# Altium project FlightController.PrjPcb
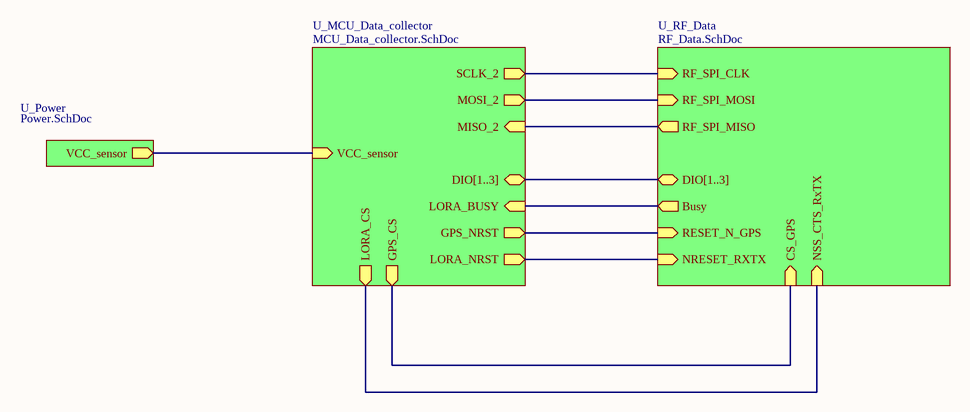
[diagram p0: Sheet1.SchDoc]
4 sheets, 100 parts. Net scope: hierarchical (ports join the sheet entries above them; power ports are global).
Board file: FlightControllerPCB.PcbDoc
Sheets:
  Sheet1.SchDoc
    U_RF_Data = RF_Data.SchDoc
    U_MCU_Data_collector = MCU_Data_collector.SchDoc
    U_Power = Power.SchDoc

## Sheet Sheet1.SchDoc
size A4; SheetNumber: 1; SheetTotal: 4

### Sub-sheets
U_MCU_Data_collector = MCU_Data_collector.SchDoc: DIO[1..3] (bidir), MOSI_2 (out), MISO_2 (in), SCLK_2 (out), LORA_CS (out), LORA_BUSY (in), LORA_NRST (out), GPS_NRST (out), GPS_CS (out), VCC_sensor (in)
U_Power = Power.SchDoc: VCC_sensor (out)
U_RF_Data = RF_Data.SchDoc: RF_SPI_CLK (in), RF_SPI_MISO (out), RF_SPI_MOSI (in), CS_GPS (in), NSS_CTS_RxTX (in), Busy (out), DIO[1..3] (bidir), NRESET_RXTX (in), RESET_N_GPS (in)

### Nets
Busy: sheet U_RF_Data/Busy, sheet U_MCU_Data_collector/LORA_BUSY
CS_GPS: sheet U_RF_Data/CS_GPS, sheet U_MCU_Data_collector/GPS_CS
GPS_NRST: sheet U_RF_Data/RESET_N_GPS, sheet U_MCU_Data_collector/GPS_NRST
LORA_CS: sheet U_RF_Data/NSS_CTS_RxTX, sheet U_MCU_Data_collector/LORA_CS
LORA_NRST: sheet U_RF_Data/NRESET_RXTX, sheet U_MCU_Data_collector/LORA_NRST
MISO_2: sheet U_RF_Data/RF_SPI_MISO, sheet U_MCU_Data_collector/MISO_2
MOSI_2: sheet U_RF_Data/RF_SPI_MOSI, sheet U_MCU_Data_collector/MOSI_2
SCLK_2: sheet U_RF_Data/RF_SPI_CLK, sheet U_MCU_Data_collector/SCLK_2
VCC_sensor: sheet U_MCU_Data_collector/VCC_sensor, sheet U_Power/VCC_sensor

### Buses and harness runs
bus sheet U_MCU_Data_collector/DIO[1..3] = sheet U_RF_Data/DIO[1..3]

## Sheet RF_Data.SchDoc
size A4; SheetNumber: 3; SheetTotal: 4
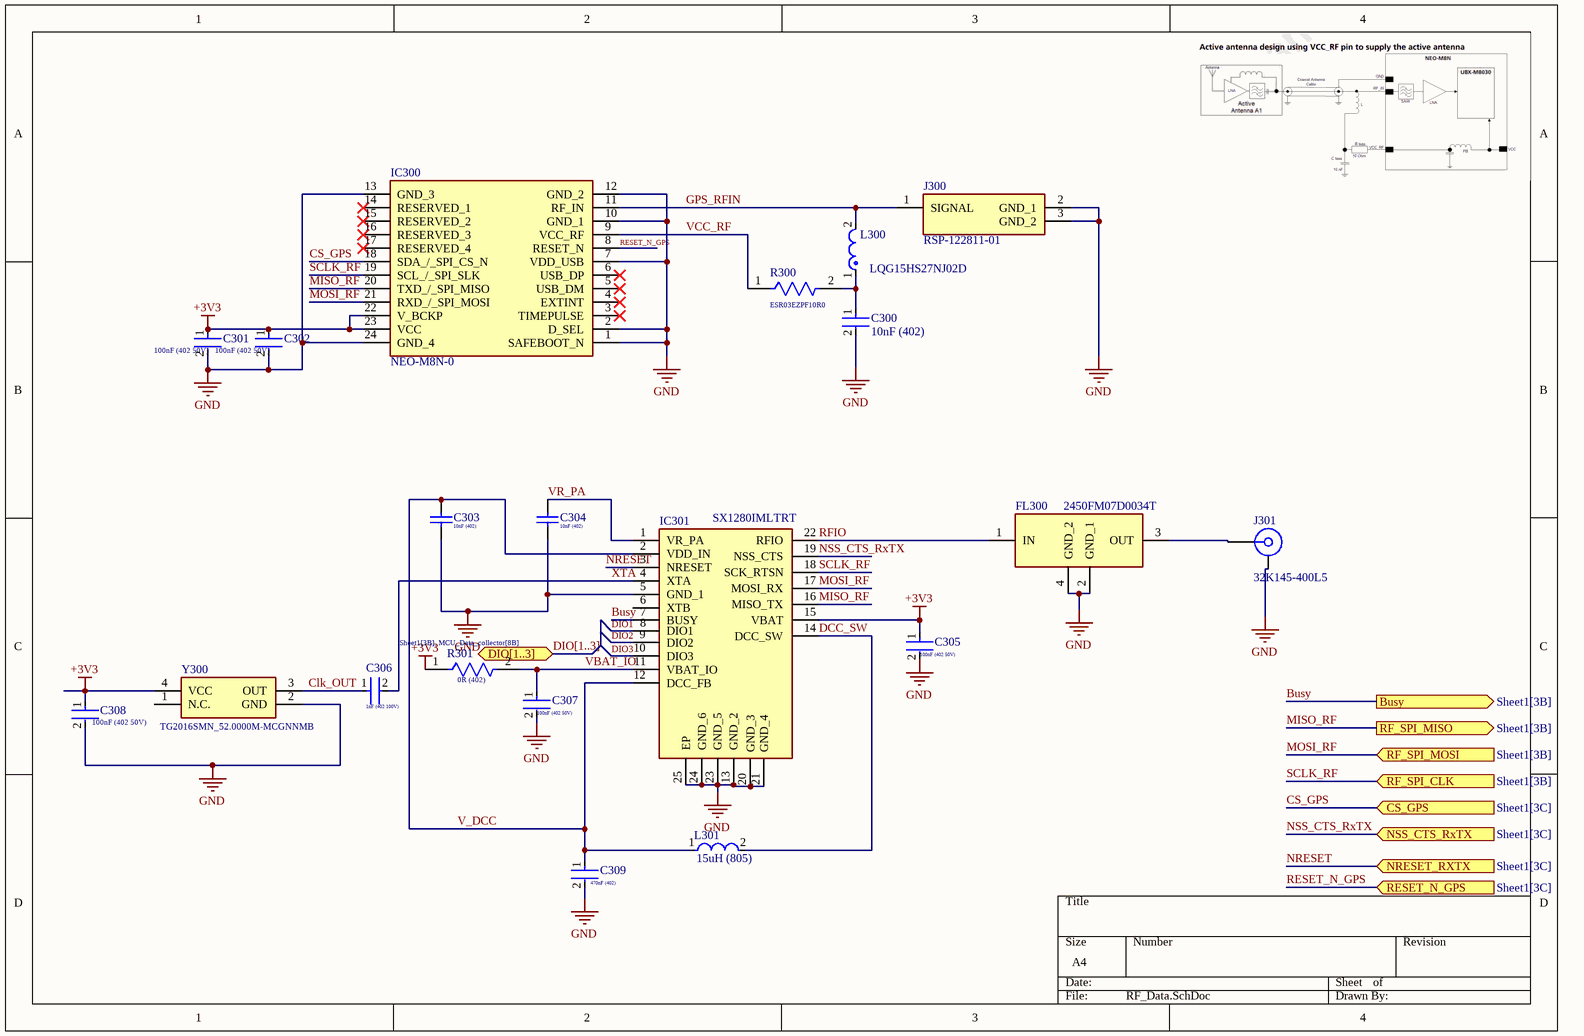
[diagram p1: RF_Data.SchDoc]

### Parts
C300  10nF (402)  [FP-CL165-IPC_C]
C301  100nF (402 50V)  [FP-CL779-IPC_C]
C302  100nF (402 50V)  [FP-CL779-IPC_C]
C303  10nF (402)  [CAPC1005X55X25LL05T10]
C304  10nF (402)  [CAPC1005X55X25LL05T10]
C305  100nF (402 50V)  [FP-CL779-IPC_C]
C306  1nF (402 100V)  [FP-GCM155-0_05-MFG]
C307  100nF (402 50V)  [FP-CL779-IPC_C]
C308  100nF (402 50V)  [FP-CL779-IPC_C]
C309  470nF (402)  [FP-GRM15-0_1-MFG]
FL300  2450FM07D0034T  [2450FM07D0034T]
IC300  NEO-M8N-0  [NEO-M8T]
IC301  SX1280IMLTRT  [QFN50P400X400X100-25N-D]
J300  RSP-122811-01  [RSP12281101]
J301  32K145-400L5  [ROS-32K145-400L5_V]
L300  LQG15HS27NJ02D  [FP-LQG15HH_02-IPC_C]
L301  15uH (805)  [FP-MLZ2012-1_25-IPC_C]
R300  ESR03EZPF10R0  [FP-ESR03-IPC_B]
R301  0R (402)  [FP-CRCW0402-e3-IPC_C]
Y300  TG2016SMN_52.0000M-MCGNNMB  [TG2016SMN520000MMCGNNMB]

### Ports
Busy (out, see Sheet1[3B]), CS_GPS (in, see Sheet1[3C]), DIO[1..3] (bidir, see Sheet1[3B], MCU_Data_collector[8B]), NRESET_RXTX (in, see Sheet1[3C]), NSS_CTS_RxTX (in, see Sheet1[3C]), RESET_N_GPS (in, see Sheet1[3C]), RF_SPI_CLK (in, see Sheet1[3B]), RF_SPI_MISO (out, see Sheet1[3B]), RF_SPI_MOSI (in, see Sheet1[3B])

### Nets
+3V3: C301.1 C302.1 C305.1 C308.1 IC300.22(V_BCKP) IC300.23(VCC) IC301.15(VBAT) R301.1 Y300.4(VCC)
GND: C300.2 C301.2 C302.2 C303.1 C304.1 C305.2 C307.2 C308.2 C309.2 FL300.2(GND_1) FL300.4(GND_2) IC300.1(SAFEBOOT_N) IC300.2(D_SEL) IC300.7(VDD_USB) IC300.10(GND_1) IC300.12(GND_2) IC300.13(GND_3) IC300.24(GND_4) IC301.5(GND_1) IC301.13(GND_2) IC301.20(GND_3) IC301.21(GND_4) IC301.23(GND_5) IC301.24(GND_6) IC301.25(EP) J300.2(GND_1) J300.3(GND_2) J301.MP Y300.2(GND)
Busy: IC301.7(BUSY) ; port Busy
Clk_OUT: C306.1 Y300.3(OUT)
CS_GPS: IC300.18(SDA_/_SPI_CS_N) ; port CS_GPS
DCC_SW: IC301.14(DCC_SW) L301.2
DIO1: IC301.8(DIO1)
DIO2: IC301.9(DIO2)
DIO3: IC301.10(DIO3)
GPS_RFIN: IC300.11(RF_IN) J300.1(SIGNAL) L300.2
MISO_RF: IC300.20(TXD_/_SPI_MISO) IC301.16(MISO_TX) ; port RF_SPI_MISO  [project net MISO_2]
MOSI_RF: IC300.21(RXD_/_SPI_MOSI) IC301.17(MOSI_RX) ; port RF_SPI_MOSI  [project net MOSI_2]
NRESET: IC301.3(NRESET) ; port NRESET_RXTX  [project net LORA_NRST]
NSS_CTS_RxTX: IC301.19(NSS_CTS) ; port NSS_CTS_RxTX  [project net LORA_CS]
RESET_N_GPS: IC300.8(RESET_N) ; port RESET_N_GPS  [project net GPS_NRST]
RFIO: FL300.1(IN) IC301.22(RFIO)
SCLK_RF: IC300.19(SCL_/_SPI_SLK) IC301.18(SCK_RTSN) ; port RF_SPI_CLK  [project net SCLK_2]
V_DCC: C303.2 C309.1 IC301.2(VDD_IN) IC301.12(DCC_FB) L301.1
VBAT_IO: C307.1 IC301.11(VBAT_IO) R301.2
VCC_RF: IC300.9(VCC_RF) R300.1
VR_PA: C304.2 IC301.1(VR_PA)
XTA: C306.2 IC301.4(XTA)
NetC300_1: C300.1 L300.1 R300.2
NetFL300_3: FL300.3(OUT) J301.1

Not connected (* = marked no-connect by the designer): IC300 3(TIMEPULSE)* 4(EXTINT)* 5(USB_DM)* 6(USB_DP)* 14(RESERVED_1)* 15(RESERVED_2)* 16(RESERVED_3)* 17(RESERVED_4)*; IC301 6(XTB); Y300 1(N.C.)

### Buses and harness runs
bus DIO[1..3] = port DIO[1..3]

### Library data of the parts
C300 = CMP-13271-000387-1: Cap Ceramic 10nF 50V X7R ±10% SMD 0402 +125°C Paper T/R; Depth: 0.5mm; Length: 1mm; Lead Free: Lead Free; Case Code (Metric): 1005; Width: 0.02inch; Min Operating Temperature: -55°C; Thickness: 0.022inch; Package Quantity: 1; Mount: Surface Mount; Height: 0.5mm; Voltage: 50V; Material: Ceramic; Tolerance: 10%; Case Code (Imperial): 0402; Radiation Hardening: No; Case/Package: 0402; Max Operating Temperature: 125°C; Voltage Rating (DC): 50V; Contact Plating: Tin; Packaging: Tape and Reel; Voltage Rating: 50V; Capacitance: 10nF; Dielectric: X7R
C301 C302 C305 C307 C308 = CMP-13271-002336-1: Cap Ceramic 100nF 50V X7R ±10% SMD 0402 +125°C Paper T/R
C303 C304 = CMP-1034-01880-2: Manufacturer: Murata; Part Number: GRM155R71E103KA01D
C306 = CMP-2008-03735-2: Ceramic Capacitor for Automotive 1nF ±10% 100VDC X7R 0402 Paper T/R; Voltage Rating: 100V; Voltage: 100V; Packaging: Tape and Reel; Width: 0.02inch; Voltage Rating (DC): 100V; Termination: SMD/SMT; Depth: 0.5mm; Max Operating Temperature: 125°C; Package Quantity: 1; Case Code (Metric): 1005; Thickness: 0.022inch; Ratings: AEC-Q200; Dielectric: X7R; Height: 0.5mm; Case/Package: 0402; Case Code (Imperial): 0402; Capacitance: 1nF; Radiation Hardening: No; Tolerance: 10%; Mount: Surface Mount; Min Operating Temperature: -55°C; REACH SVHC: No SVHC; Length: 1mm
C309 = CMP-2000-05009-2: CAP CER 0.47UF 10V X5R 0402; Manufacturer: Murata Electronics North America; Manufacturer Part Number: GRM155R61A474KE15D; Temperature Coefficient: 15%; Material: Ceramic; Tolerance: 10%; Device Class L3: Ceramic Capacitors; ComponentLink2Description: Datasheet; ComponentLink2URL: https://search.murata.co.jp/Ceramy/image/img/A01X/G101/ENG/GRM155R61A474KE15-01A.pdf; Package: GRM15-0.1; Voltage Rating: 10V; Capacitance: 0.47uF; Category: Cap; Temperature Range High: +85°C; Temperature Range Low: -55°C; Height: 0.55mm; Device Class L2: Capacitors; Lead Free: Yes; Mouser Description: Multilayer Ceramic Capacitors MLCC - SMD/SMT 0402 0.47uF 10volts X5R 10%; Ipc Land Pattern Name: CAPC10050X50; Temperature Characteristic: X5R; Digikey Description: CAP CER 0.47UF 10V X5R 0402; Value: 0.47uF; Octopart: https://octopart.com/grm155r61a474ke15d-murata-196883; Automotive: No; Device Class L1: Passive Components; Temperature: -55°C to +85°C; RoHS: TRUE
FL300 = 2450FM07D0034T: Filter; Manufacturer_Name: JOHANSON TECHNOLOGY; Datasheet Link: https://www.mouser.co.uk/datasheet/2/611/2450FM07D0034-1375634.pdf; Height: 0.4mm; Manufacturer_Part_Number: 2450FM07D0034T; Mouser Part Number: 609-2450FM07D0034T; Mouser Price/Stock: https://www.mouser.co.uk/ProductDetail/Johanson-Technology/2450FM07D0034T?qs=%252BEew9%252B0nqrBEY7VUloPs4Q%3D%3D; Arrow Part Number: 2450FM07D0034T; Arrow Price/Stock: https://www.arrow.com/en/products/2450fm07d0034t/johanson-dielectrics?region=nac
IC300 = NEO-M8N-0: Integrated Circuit; Manufacturer_Name: U-Blox; Datasheet Link: https://www.u-blox.com/sites/default/files/NEO-M8-FW3_DataSheet_%28UBX-15031086%29.pdf; Manufacturer_Part_Number: NEO-M8N-0; Mouser Part Number: 377-NEO-M8N-0; Mouser Price/Stock: https://www.mouser.co.uk/ProductDetail/u-blox/NEO-M8N-0?qs=zW32dvEIR3unZhZI0KRbew%3D%3D
IC301 = SX1280IMLTRT: Integrated Circuit; Manufacturer_Name: SEMTECH; Datasheet Link: https://datasheet.datasheetarchive.com/originals/distributors/DKDS-37/728740.pdf; Height: 1mm; Manufacturer_Part_Number: SX1280IMLTRT; Mouser Part Number: 947-SX1280IMLTRT; Mouser Price/Stock: https://www.mouser.co.uk/ProductDetail/Semtech/SX1280IMLTRT?qs=5aG0NVq1C4xuoq8G6ZzdxQ%3D%3D; Arrow Part Number: SX1280IMLTRT; Arrow Price/Stock: https://www.arrow.com/en/products/sx1280imltrt/semtech?region=nac
J300 = RSP-122811-01: Connector; Manufacturer_Name: SAMTEC; Datasheet Link: http://suddendocs.samtec.com/prints/rsp-122811-01-mkt.pdf; Height: 1.28mm; Manufacturer_Part_Number: RSP-122811-01; Mouser Part Number: 200-RSP-122811-01; Mouser Price/Stock: https://www.mouser.co.uk/ProductDetail/Samtec/RSP-122811-01?qs=92ilVni64gyF7Cx4LepixQ%3D%3D; Arrow Part Number: RSP-122811-01; Arrow Price/Stock: https://www.arrow.com/en/products/rsp-122811-01/samtec?region=nac
J301 = CMP-0751-00004-2: SMA Right Angle Jack, Edge Mount, Up to 18 GHz, -55 to 155 degC; Manufacturer: Rosenberger; Desgin Note 2: For more information about DRC setting, please look at following webpage, http://techdocs.altium.com/display/SCRT/Design+Rule+for+Edge-Mount+Connectors; Design Note 1: Footprint in library is a generic example - only application specific footprint delivers High Performance; ComponentLink5Description: Webshop / RFQ; ComponentLink5URL: http://www.rosenberger.com/en/contact/sales/; ComponentLink3URL: http://rosenberger.de/ok/images/documents/db/32K145-400L5.pdf; DatasheetVersion: b00; ComponentLink2URL: http://rosenberger.de/ok/images/documents/db/32K145-400L5.pdf; ComponentLink4Description: Series Overview / Design Note; ComponentLink1Description: Manufacturer URL; PackageReference: 32K145-400L5; ComponentLink2Description: Datasheet; PartNumber: 32K145-400L5; PackageVersion: b00; PackageDescription: SMA Right Angle Jack, Edge Mount, 14.25 x 9.5 x 4.46 mm; ComponentLink3Description: Package Specification; ComponentLink1URL: http://www.rosenberger.de; ComponentLink4URL: http://rosenberger.de/ok/images/documents/spez/32.pdf; Mounting Technology: Surface Mount
L300 = CMP-2000-06578-2: Multilayer type RF Inductor 27nH ±5% 0.46Ω 350mA 0402; DC Current: 300mA; Core Material: Air; Self Resonant Frequency: 1.7GHz; Q Factor: 8; DC Resistance (DCR): 460mR; Shielding: Unshielded; Test Frequency: 100MHz; Inductance: 27nH; Width: 0.02inch; Length: 1mm; Height - Seated (Max): 0.022inch; Military Standard: Not; Case Code (Imperial): 0402; Tolerance: 5%; Depth: 0.55mm; Current Rating: 300mA; Inductance Tolerance: 5%; Lead Free: Lead Free; Height: 0.5mm; Max DC Current: 300mA; REACH SVHC: No SVHC; Package Quantity: 10000; Mount: Surface Mount; Termination: SMD/SMT; Case Code (Metric): 1005; Case/Package: 0402; Max Operating Temperature: 125°C; Packaging: Tape and Reel; Min Operating Temperature: -55°C
L301 = CMP-08253-000252-1: Shielded Multilayer Inductor 15uH ±20% 250mA 1235mΩ SMD 0805; Core Material: Ferrite; Saturation Current: 120mA; DC Resistance (DCR): 1.235R; Test Frequency: 2MHz; Self Resonant Frequency: 40MHz; Case/Package: 0805; Mount: Surface Mount; Package Quantity: 1; Current Rating: 250mA; Inductance: 15uH; Case Code (Metric): 2012; Max Operating Temperature: 125°C; Height - Seated (Max): 0.057inch; Width: 0.049inch; Length: 0.079inch; Shielding: Shielded; RoHS Compliant: Yes; Case Code (Imperial): 0805; Packaging: Tape and Reel; Min Operating Temperature: -55°C; Tolerance: 20%
R300 = CMP-08839-031885-1: RES SMD 10 OHM 1% 1/4W 0603; Max Power Dissipation: 250mW; Resistance: 10R; Temperature Coefficient: 100ppm/°C; Max Operating Temperature: 155°C; Lead Free: Lead Free; Case Code (Metric): 1608; Series: ESR; Packaging: Tape and Reel; Features: Automotive AEC-Q200; Number of Terminations: 2; RoHS Compliant: Yes; Min Operating Temperature: -55°C; Width: 0.8mm; Length: 1.6mm; Case/Package: 0603; Height: 0.45mm; Tolerance: 1%; Case Code (Imperial): 0603
R301 = CMP-2002-08122-2: RES Thick Film, 0Ω, 0.063W, 0402; Tolerance: 5%; Max Power Dissipation: 63mW; Voltage Rating: 50V; Temperature Coefficient: 100ppm/°C; Resistance: 0mR; Contact Plating: Tin; Height: 0.35mm; Radiation Hardening: No; Features: Automotive AEC-Q200; Composition: Thick Film; Width: 0.5mm; Weight: 2.3E-05oz; Termination: SMD/SMT; Packaging: Tape and Reel; Mount: Surface Mount; Case Code (Metric): 1005; Military Standard: Not; Min Operating Temperature: -55°C; Number of Terminations: 2; Package Quantity: 1; Case Code (Imperial): 0402; Depth: 0.5mm; Max Operating Temperature: 155°C; Case/Package: 0402; Power Rating: 63mW; Lead Free: Lead Free; Voltage Rating (DC): 50V; Length: 1mm
Y300 = TG2016SMN_52.0000M-MCGNNMB: Crystal or Oscillator; Manufacturer_Name: Epson Timing; Manufacturer_Part_Number: TG2016SMN 52.0000M-MCGNNMB; Datasheet Link: https://support.epson.biz/td/api/doc_check.php?dl=app_TG2016SMN&lang=en; Height: 0.8mm

## Sheet MCU_Data_collector.SchDoc
size A2; SheetNumber: 4; SheetTotal: 4
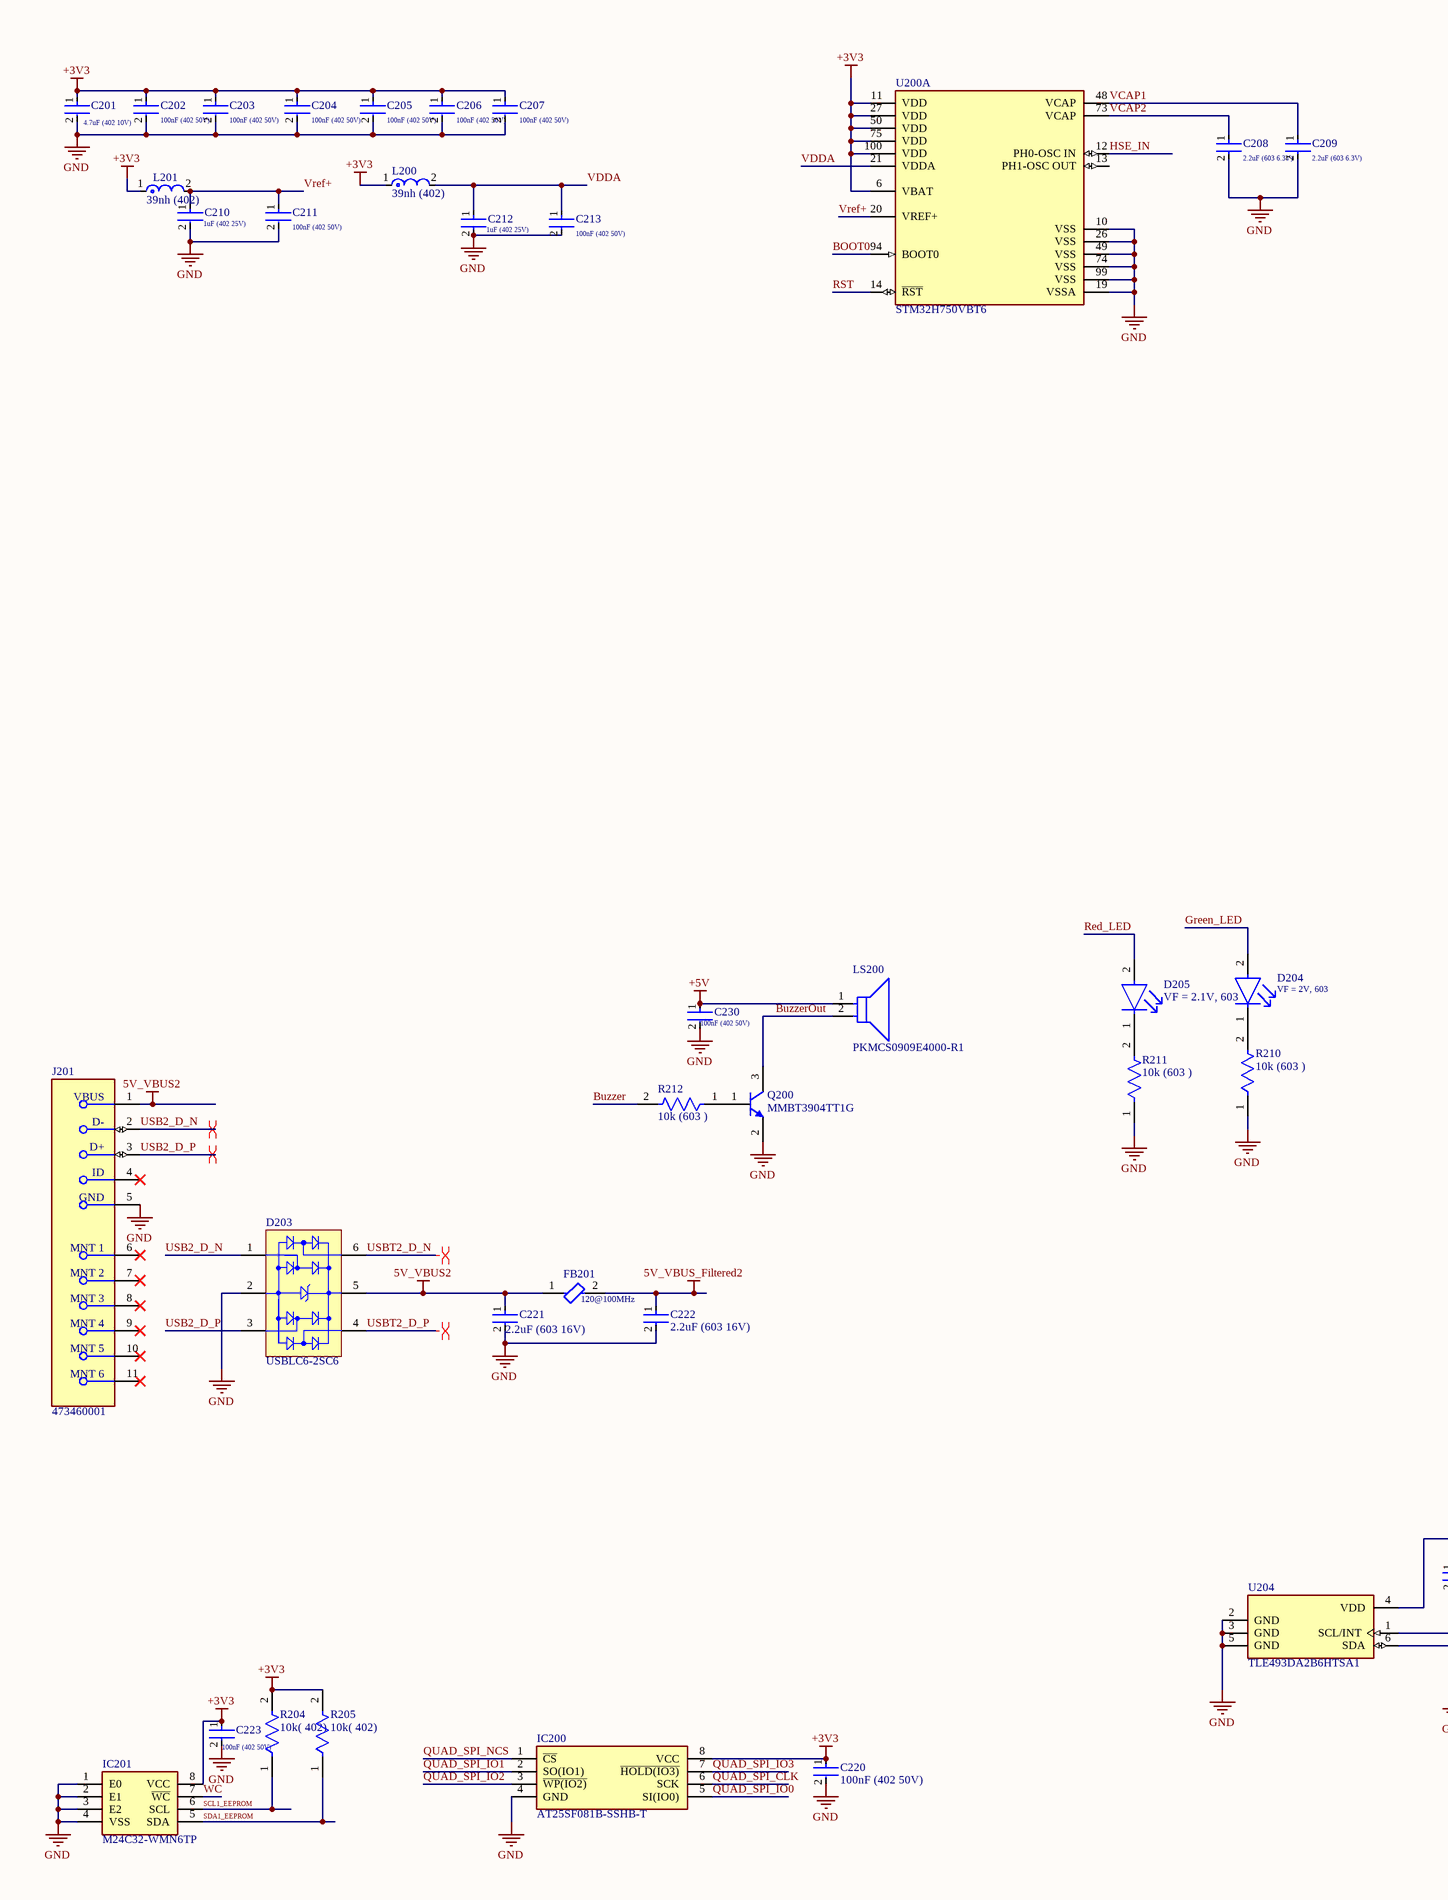
[diagram p2: MCU_Data_collector.SchDoc, left]
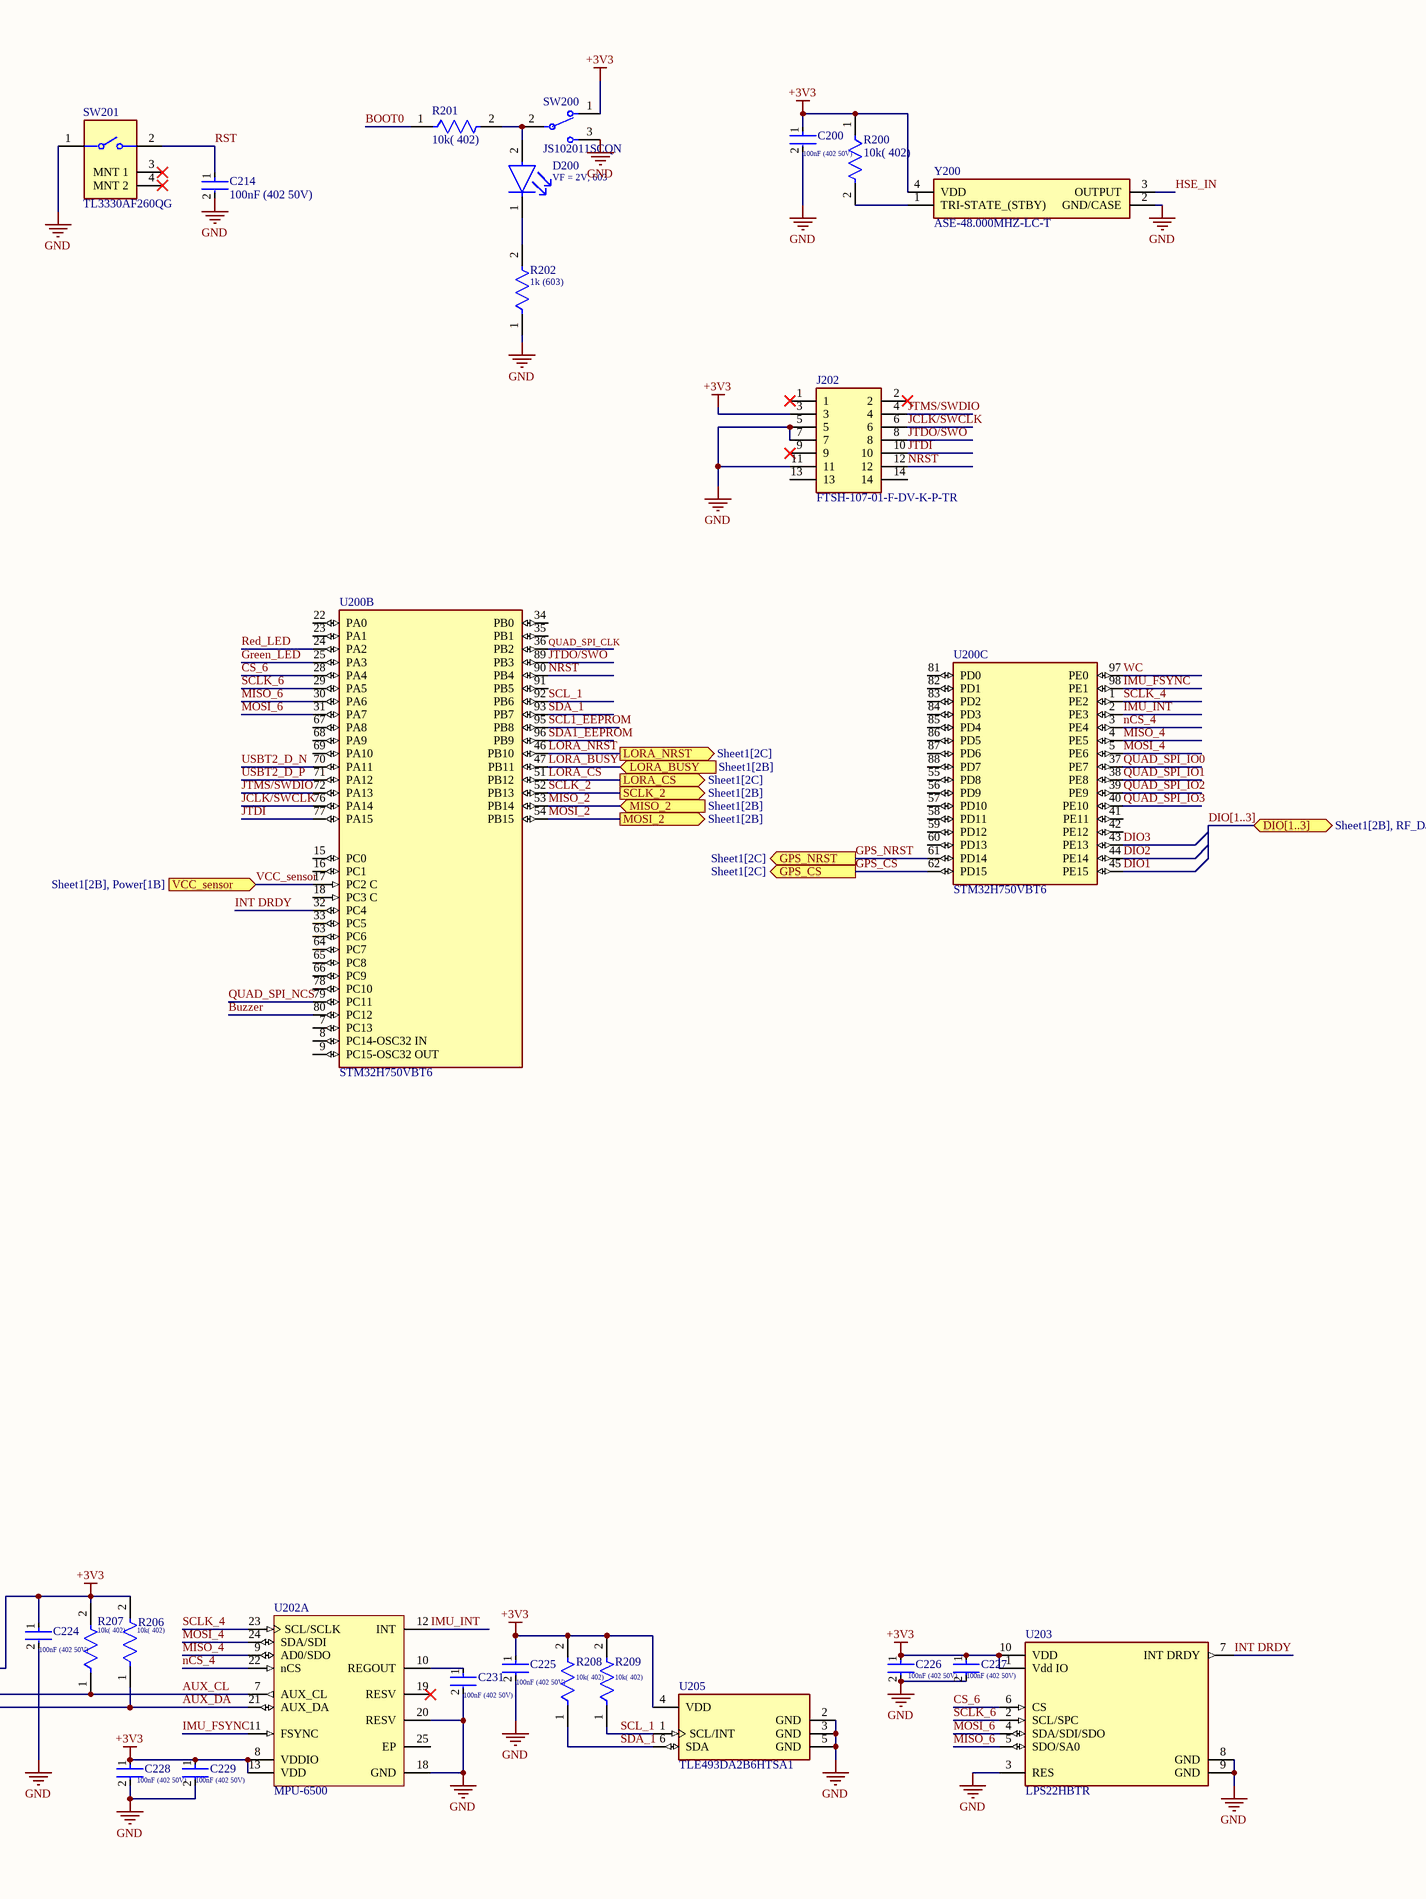
[diagram p3: MCU_Data_collector.SchDoc, right]

### Parts
C200  100nF (402 50V)  [FP-CL779-IPC_C]
C201  4.7uF (402 10V)  [FP-CL282-IPC_C]
C202  100nF (402 50V)  [FP-CL779-IPC_C]
C203  100nF (402 50V)  [FP-CL779-IPC_C]
C204  100nF (402 50V)  [FP-CL779-IPC_C]
C205  100nF (402 50V)  [FP-CL779-IPC_C]
C206  100nF (402 50V)  [FP-CL779-IPC_C]
C207  100nF (402 50V)  [FP-CL779-IPC_C]
C208  2.2uF (603 6.3V)  [FP-CL50-IPC_C]
C209  2.2uF (603 6.3V)  [FP-CL50-IPC_C]
C210  1uF (402 25V)  [FP-CL542-IPC_C]
C211  100nF (402 50V)  [FP-CL779-IPC_C]
C212  1uF (402 25V)  [FP-CL542-IPC_C]
C213  100nF (402 50V)  [FP-CL779-IPC_C]
C214  100nF (402 50V)  [FP-CL779-IPC_C]
C220  100nF (402 50V)  [FP-CL779-IPC_C]
C221  2.2uF (603 16V)  [FP-CL10-IPC_A]
C222  2.2uF (603 16V)  [FP-CL10-IPC_A]
C223  100nF (402 50V)  [FP-CL779-IPC_C]
C224  100nF (402 50V)  [FP-CL779-IPC_C]
C225  100nF (402 50V)  [FP-CL779-IPC_C]
C226  100nF (402 50V)  [FP-CL779-IPC_C]
C227  100nF (402 50V)  [FP-CL779-IPC_C]
C228  100nF (402 50V)  [FP-CL779-IPC_C]
C229  100nF (402 50V)  [FP-CL779-IPC_C]
C230  100nF (402 50V)  [FP-CL779-IPC_C]
C231  100nF (402 50V)  [FP-CL779-IPC_C]
D200  VF = 2V, 603  [FP-LTST-C191KGKT-MFG]
D203  USBLC6-2SC6  [STM-SOT23-6L_V]
D204  VF = 2V, 603  [FP-LTST-C191KGKT-MFG]
D205  VF = 2.1V, 603  [FP-LTST-C190KRKT-MFG]
FB201  120@100MHz  [FP-BLM18-0_15-t0_8-MFG]
IC200  AT25SF081B-SSHB-T  [SOIC127P600X175-8N]
IC201  M24C32-WMN6TP  [SOIC127P600X175-8N]
J201  473460001  [FP-473460001-MFG]
J202  FTSH-107-01-F-DV-K-P-TR  [FTSH-107-XX-YYY-DV-K-P-TR]
L200  39nh (402)  [FP-LQG15HH_02-MFG]
L201  39nh (402)  [FP-LQG15HH_02-MFG]
LS200  PKMCS0909E4000-R1  [FP-PKMCS-MFG]
Q200  MMBT3904TT1G  [ONSC-SC-75-3-463-01_V]
R200  10k( 402)  [FP-RC0402-0_4-IPC_C]
R201  10k( 402)  [FP-RC0402-0_4-IPC_C]
R202  1k (603)  [FP-CRCW0603-e3-MFG]
R204  10k( 402)  [FP-RC0402-0_4-IPC_C]
R205  10k( 402)  [FP-RC0402-0_4-IPC_C]
R206  10k( 402)  [FP-RC0402-0_4-IPC_C]
R207  10k( 402)  [FP-RC0402-0_4-IPC_C]
R208  10k( 402)  [FP-RC0402-0_4-IPC_C]
R209  10k( 402)  [FP-RC0402-0_4-IPC_C]
R210  10k (603 )  [FP-ESR03-IPC_C]
R211  10k (603 )  [FP-ESR03-IPC_C]
R212  10k (603 )  [FP-ESR03-IPC_C]
SW200  JS102011SCQN  [FP-JS102011SCQN-MFG]
SW201  TL3330AF260QG  [FP-TL3330AF260QG-MFG]
U200  STM32H750VBT6  [FP-LQFP100-1L-MFG]  (parts A,B,C of 3)
U202  MPU-6500  [INSE-MPU-6500-QFN24_M]  (part A of 2)
U203  LPS22HBTR  [FP-HLGA-10L-8479831-0]
U204  TLE493DA2B6HTSA1  [FP-PG-TSOP6-6-MFG]
U205  TLE493DA2B6HTSA1  [FP-PG-TSOP6-6-MFG]
Y200  ASE-48.000MHZ-LC-T  [ASE24576MHZLCT]

### Ports
DIO[1..3] (bidir, see Sheet1[2B], RF_Data[2C]), GPS_CS (out, see Sheet1[2C]), GPS_NRST (out, see Sheet1[2C]), LORA_BUSY (in, see Sheet1[2B]), LORA_CS (out, see Sheet1[2C]), LORA_NRST (out, see Sheet1[2C]), MISO_2 (in, see Sheet1[2B]), MOSI_2 (out, see Sheet1[2B]), SCLK_2 (out, see Sheet1[2B]), VCC_sensor (in, see Sheet1[2B], Power[1B])

### Nets
5V_VBUS2: C221.1 D203.5(VBUS) FB201.1 J201.1(VBUS)
5V_VBUS_Filtered2: C222.1 FB201.2
+3V3: C200.1 C201.1 C202.1 C203.1 C204.1 C205.1 C206.1 C207.1 C220.1 C223.1 C224.1 C225.1 C226.1 C227.1 C228.1 C229.1 IC200.8(VCC) IC201.8(VCC) J202.3 L200.1 L201.1 R200.1 R204.2 R205.2 R206.2 R207.2 R208.2 R209.2 SW200.1 U200.6(VBAT) U200.11(VDD) U200.27(VDD) U200.50(VDD) U200.75(VDD) U200.100(VDD) U202.8(VDDIO) U202.13(VDD) U203.1(Vdd_IO) U203.10(VDD) U204.4(VDD) U205.4(VDD) Y200.4(VDD)
+5V: C230.1 LS200.1(C)
GND: C200.2 C201.2 C202.2 C203.2 C204.2 C205.2 C206.2 C207.2 C208.2 C209.2 C210.2 C211.2 C212.2 C213.2 C214.2 C220.2 C221.2 C222.2 C223.2 C224.2 C225.2 C226.2 C227.2 C228.2 C229.2 C230.2 C231.2 D203.2(GND) IC200.4(GND) IC201.1(E0) IC201.2(E1) IC201.3(E2) IC201.4(VSS) J201.5(GND) J202.5 J202.7 J202.11 Q200.2(E) R202.1 R210.1 R211.1 SW200.3 SW201.1 U200.10(VSS) U200.19(VSSA) U200.26(VSS) U200.49(VSS) U200.74(VSS) U200.99(VSS) U202.18(GND) U202.20(RESV) U203.3(RES) U203.8(GND) U203.9(GND) U204.2(GND) U204.3(GND) U204.5(GND) U205.2(GND) U205.3(GND) U205.5(GND) Y200.2(GND/CASE)
AUX_CL: R207.1 U202.7(AUX_CL) U204.1(SCL/INT)
AUX_DA: R206.1 U202.21(AUX_DA) U204.6(SDA)
BOOT0: R201.1 U200.94(BOOT0)
Buzzer: R212.2 U200.80(PC12)
BuzzerOut: LS200.2(A) Q200.3(C)
CS_6: U200.28(PA4) U203.6(CS)
DIO1: U200.45(PE15)
DIO2: U200.44(PE14)
DIO3: U200.43(PE13)
GPS_CS: U200.62(PD15) ; port GPS_CS  [project net CS_GPS]
GPS_NRST: U200.61(PD14) ; port GPS_NRST
Green_LED: D204.2(A) U200.25(PA3)
HSE_IN: U200.12(PH0-OSC_IN) Y200.3(OUTPUT)
IMU_FSYNC: U200.98(PE1) U202.11(FSYNC)
IMU_INT: U200.2(PE3) U202.12(INT)
INT DRDY: U200.32(PC4) U203.7(INT_DRDY)
JCLK/SWCLK: J202.6 U200.76(PA14)
JTDI: J202.10 U200.77(PA15)
JTDO/SWO: J202.8 U200.89(PB3)
JTMS/SWDIO: J202.4 U200.72(PA13)
LORA_BUSY: U200.47(PB11) ; port LORA_BUSY  [project net Busy]
LORA_CS: U200.51(PB12) ; port LORA_CS
LORA_NRST: U200.46(PB10) ; port LORA_NRST
MISO_2: U200.53(PB14) ; port MISO_2
MISO_4: U200.4(PE5) U202.9(AD0/SDO)
MISO_6: U200.30(PA6) U203.5(SDO/SA0)
MOSI_2: U200.54(PB15) ; port MOSI_2
MOSI_4: U200.5(PE6) U202.24(SDA/SDI)
MOSI_6: U200.31(PA7) U203.4(SDA/SDI/SDO)
nCS_4: U200.3(PE4) U202.22(nCS)
NRST: J202.12 U200.90(PB4)
QUAD_SPI_CLK: IC200.6(SCK) U200.36(PB2)
QUAD_SPI_IO0: IC200.5(SI(IO0)) U200.37(PE7)
QUAD_SPI_IO1: IC200.2(SO(IO1)) U200.38(PE8)
QUAD_SPI_IO2: IC200.3(~{WP(IO2)}) U200.39(PE9)
QUAD_SPI_IO3: IC200.7(~{HOLD(IO3)}) U200.40(PE10)
QUAD_SPI_NCS: IC200.1(~{CS}) U200.79(PC11)
Red_LED: D205.2(A) U200.24(PA2)
RST: C214.1 SW201.2 U200.14(~{RST})
SCL1_EEPROM: IC201.6(SCL) R204.1 U200.95(PB8)
SCL_1: R209.1 U200.92(PB6) U205.1(SCL/INT)
SCLK_2: U200.52(PB13) ; port SCLK_2
SCLK_4: U200.1(PE2) U202.23(SCL/SCLK)
SCLK_6: U200.29(PA5) U203.2(SCL/SPC)
SDA1_EEPROM: IC201.5(SDA) R205.1 U200.96(PB9)
SDA_1: R208.1 U200.93(PB7) U205.6(SDA)
USB2_D_N: D203.1(I/O_1) J201.2(D-)
USB2_D_P: D203.3(I/O_2) J201.3(D+)
USBT2_D_N: D203.6(I/O_4) U200.70(PA11)
USBT2_D_P: D203.4(I/O_3) U200.71(PA12)
VCAP1: C209.1 U200.48(VCAP)
VCAP2: C208.1 U200.73(VCAP)
VCC_sensor: U200.17(PC2_C) ; port VCC_sensor
VDDA: C212.1 C213.1 L200.2 U200.21(VDDA)
Vref+: C210.1 C211.1 L201.2 U200.20(VREF+)
WC: IC201.7(~{WC}) U200.97(PE0)
NetC231_1: C231.1 U202.10(REGOUT)
NetD200_1: D200.1(C) R202.2
NetD200_2: D200.2(A) R201.2 SW200.2(C)
NetD204_1: D204.1(C) R210.2
NetD205_1: D205.1(C) R211.2
NetQ200_1: Q200.1(B) R212.1
NetR200_2: R200.2 Y200.1(TRI-STATE_(STBY))

Not connected (* = marked no-connect by the designer): J201 4(ID)* 6(MNT_1)* 7(MNT_2)* 8(MNT_3)* 9(MNT_4)* 10(MNT_5)* 11(MNT_6)*; J202 1* 2* 9* 13 14; SW201 3(MNT_1)* 4(MNT_2)*; U200 7(PC13) 8(PC14-OSC32_IN) 9(PC15-OSC32_OUT) 13(PH1-OSC_OUT) 15(PC0) 16(PC1) 18(PC3_C) 22(PA0) 23(PA1) 33(PC5) 34(PB0) 35(PB1) 41(PE11) 42(PE12) 55(PD8) 56(PD9) 57(PD10) 58(PD11) 59(PD12) 60(PD13) 63(PC6) 64(PC7) 65(PC8) 66(PC9) 67(PA8) 68(PA9) 69(PA10) 78(PC10) 81(PD0) 82(PD1) 83(PD2) 84(PD3) 85(PD4) 86(PD5) 87(PD6) 88(PD7) 91(PB5); U202 19(RESV)* 25(EP)

### Buses and harness runs
bus DIO[1..3] = port DIO[1..3]

### Layout directives
differential pair: USB2_D_N, USB2_D_P, USBT2_D_N, USBT2_D_P

### Library data of the parts
C200 C202-C207 C211 C213 C214 C220 C223-C231 = CMP-13271-002336-1: as C301 on sheet RF_Data
C201 = CMP-13271-000548-1: Cap Ceramic 4.7uF 10V X5R ±20% SMD 0402 +85°C Paper T/R; Capacitance: 4.7uF; Max Operating Temperature: 85°C; Lead Free: Lead Free; Tolerance: 20%; Voltage Rating: 10V; Dielectric: X5R; Width: 0.02inch; Length: 0.039inch; Case/Package: 0402; Min Operating Temperature: -55°C; Packaging: Tape and Reel; Thickness: 0.022inch; Case Code (Imperial): 0402; Package Quantity: 10000; Case Code (Metric): 1005; Mount: Surface Mount
C208 C209 = CMP-13271-001039-1: Cap Ceramic 2.2uF 6.3V X5R ±20% SMD 0402 +85°C Paper T/R; Length: 1mm; Capacitance: 2.2uF; Height: 0.5mm; Tolerance: 20%; Case/Package: 0402; Width: 0.02inch; Mount: Surface Mount; Case Code (Imperial): 0402; Case Code (Metric): 1005; Depth: 0.5mm; Lead Free: Lead Free; Package Quantity: 10000; Min Operating Temperature: -55°C; Max Operating Temperature: 85°C; Dielectric: X5R; Voltage Rating: 6.3V; Thickness: 0.022inch; Radiation Hardening: No; Packaging: Tape and Reel
C210 C212 = CMP-13271-001051-1: Cap Ceramic 1uF 25V X5R ±10% SMD 0402 +85°C Paper T/R; Radiation Hardening: No; Lead Free: Lead Free; Capacitance: 1uF; Package Quantity: 10000; Max Operating Temperature: 85°C; Voltage Rating: 25V; Case/Package: 0402; Min Operating Temperature: -55°C; Packaging: Tape and Reel; Tolerance: 10%; Height: 0.5mm; Thickness: 0.022inch; Case Code (Metric): 1005; Width: 0.02inch; Case Code (Imperial): 0402; Dielectric: X5R; Length: 1mm; Mount: Surface Mount; Material: Ceramic; Depth: 0.5mm
C221 C222 = CMP-13271-000835-1: Cap Ceramic 2.2uF 16V X5R ±10% Pad SMD 0603 +85°C T/R; Case Code (Metric): 1608; Height: 0.8mm; Case/Package: 0603; Depth: 0.8mm; Capacitance: 2.2uF; Voltage Rating: 16V; Case Code (Imperial): 0603; Length: 1.6mm; Packaging: Tape and Reel; Material: Ceramic; Lead Free: Lead Free; Max Operating Temperature: 85°C; Contact Plating: Tin; Thickness: 0.035inch; Radiation Hardening: No; Tolerance: 10%; Min Operating Temperature: -55°C; Voltage: 16V; Dielectric: X5R; Mount: Surface Mount; Package Quantity: 4000; Width: 0.031inch; Voltage Rating (DC): 16V
D200 D204 = CMP-2000-05198-2: LED GREEN CLEAR SMD; Max Power Dissipation: 75mW; Forward Current: 30mA; Reverse Voltage: 5V; Lens Color: Colorless; Dominant Wavelength: 571nm; Number of LEDs: 1; Viewing Angle: 130°; Lens Style: Rectangular; Test Current: 20mA; Luminous Intensity: 35mcd; Wavelength: 574nm; Width: 0.8mm; Case Code (Imperial): 0603; Number of Pins: 2; Lead Free: Lead Free; Forward Voltage: 2V; Packaging: Tape and Reel; Package Quantity: 1; Min Operating Temperature: -55°C; Case/Package: 0603; Length: 1.6mm; Power Dissipation: 75mW; Depth: 0.8mm; Radiation Hardening: No; Mount: Surface Mount; Max Operating Temperature: 85°C; Color: Green; Power Rating: 75mW; Height: 0.55mm; Illumination Color: Green; Case Code (Metric): 1608; Lens Transparency: Clear; Number of Elements: 1
D203 = CMP-2000-05378-1: Very low capacitance ESD protection, 3.5 pF, -40 to 125 degC, 6-Pin SOT23, RoHS, Tape and Reel; Manufacturer: STMicroelectronics; Polarity: Uni-Directional; Clamping Voltage: 17V; Rad Hardened: No; Product Height (mm): 1.3mm; Leakage Current (Max): 0.15uA; Product Length (mm): 3.05mm; Number of Elements: 1; Peak Pulse Current: 5A; Configuration: Dual; Reverse Breakdown Voltage: 6V; Working Voltage (Max): 5V; Capacitance Value: 3.5pF; Suppressor Type: DiodeArrays; Product Depth (mm): 1.75mm; Test Current (It): 1mA; Package / Case: SOT-23; Operating Temperature Max Deg. C: 125C; Package Description: 6-Pin Small Outline Transistor, Body 2.925 x 1.625 mm, Pitch 0.95 mm; Package Reference: SOT23-6L; Datasheet Version: Rev. 5, 10/2011; Operating Temperature Min Deg. C: -40C; Mounting Style: SurfaceMount; Direction Type: Uni-Directional; Mounting: SurfaceMount; Pin Count: 6; Leakage Current: 0.15uA; Packaging: TapeandReel; Operating Temperature Classification: Automotive; Clamping Voltage (Max): 17V; Manufacturer URL: http://www.st.com/; Reverse Stand-off Voltage: 5V; Datasheet URL: http://www.st.com/st-web-ui/static/active/en/resource/technical/document/datasheet/CD00050750.pdf; Working Voltage: 5V; Operating Temp Range: -40Cto125C
D205 = CMP-1674-00011-2: LED RED CLEAR CHIP SMD; Reverse Voltage: 5V; Viewing Angle: 130°; Power Rating: 75mW; Test Current: 20mA; Number of Elements: 1; Lens Color: Colorless; Wavelength: 639nm; Dominant Wavelength: 631nm; Lens Style: Diffused; Forward Current: 30mA; Forward Voltage: 2.4V; Luminous Intensity: 54mcd; Color: Red; Case Code (Imperial): 0603; Lens Transparency: Clear; Lead Free: Lead Free; Package Quantity: 1; Packaging: Tape and Reel; Max Operating Temperature: 85°C; Number of Pins: 2; Height: 0.8mm; Case/Package: 0603; Number of LEDs: 1; Width: 0.8mm; Case Code (Metric): 1608; Depth: 0.8mm; Mount: Surface Mount; Radiation Hardening: No; Length: 1.6mm; Illumination Color: Red; Power Dissipation: 75mW; Min Operating Temperature: -55°C
FB201 = CMP-0686-00493-3: Chip Ferrite Bead, 0603, 120Ω @ 100MHz, 0.25Ω, 25%, 200mA; Manufacturer Series: BLM18R; Shielding: Unshielded; Number of Lines: 1; Impedance: 120R; Resistance: 250mR; Material: Steel; Core Material: Ferrite; Max DC Current: 200mA; Radiation Hardening: No; Max Current Rating: 200mA; Min Operating Temperature: -55°C; REACH SVHC: No SVHC; Packaging: Tape and Reel; Depth: 0.8mm; Tolerance: 25%; Weight: 7.1E-05oz; RoHS Compliant: Yes; Case/Package: 0603; Series: BLM18R; Number of Pins: 2; Length: 1.6mm; Case Code (Imperial): 0603; Package Quantity: 1; Contact Plating: Tin; Terminal Finish: Tin; Height: 0.8mm; DC Resistance (DCR): 250mR; Lead Free: Lead Free; Number of Functions: 1; Termination: Flat; Width: 0.8mm; Case Code (Metric): 1608; Max Operating Temperature: 125°C; Number of Circuits: 1; Test Frequency: 100MHz; Current Rating: 200mA
IC200 = AT25SF081B-SSHB-T: Integrated Circuit; Manufacturer_Name: Renesas Electronics; Datasheet Link: https://www.renesas.com/us/en/products/memory-logic/non-volatile-memory/spi-nor-flash/dual-quad-spi-memory/at25sf081b-8mbit-27v-minimum-spi-serial-flash-memory-dual-io-support; Height: 1.75mm; Manufacturer_Part_Number: AT25SF081B-SSHB-T; Mouser Part Number: 724-AT25SF081BSSHBT; Mouser Price/Stock: https://www.mouser.co.uk/ProductDetail/Renesas-Dialog/AT25SF081B-SSHB-T?qs=IS%252B4QmGtzzpOC1%252BzmE%2Fn5w%3D%3D
IC201 = M24C32-WMN6TP: Integrated Circuit; Manufacturer_Name: STMicroelectronics; Datasheet Link: http://www.st.com/st-web-ui/static/active/en/resource/technical/document/datasheet/CD00001012.pdf; Height: 1.75mm; Manufacturer_Part_Number: M24C32-WMN6TP; Mouser Part Number: 511-M24C32-WMN6TP; Mouser Price/Stock: https://www.mouser.co.uk/ProductDetail/STMicroelectronics/M24C32-WMN6TP?qs=%252B9pWl1iD4MWFKTqSdEAgrw%3D%3D; Arrow Part Number: M24C32-WMN6TP; Arrow Price/Stock: https://www.arrow.com/en/products/m24c32-wmn6tp/stmicroelectronics?region=nac
J201 = CMP-2000-05246-2: CONN RCPT USB2.0 MICRO B SMD R/A; Manufacturer: Molex; Conn Orientation: Right Angle; Is Female: yes; Shielding: true; Pitch: 0.65mm; Number Of Contacts: 5; Voltage Rating: 30V; Current Rating: 1.8A; Device Class L2: USB Connectors; Digikey Description: CONN RCPT USB2.0 MICRO B SMD R/A; Height: 2.945mm; RoHS: TRUE; ComponentLink2Description: Datasheet; Octopart: https://octopart.com/47346-0001-molex-7164928; Automotive: No; Package: 0; Category: Conn; Device Class L1: Connectors; Usb Standard: USB 2.0; Temperature: -30°C to +85°C; Temperature Range Low: -30°C; Footprint Url: https://www.molex.com/pdm_docs/sd/473460001_sd.pdf; ComponentLink2URL: https://www.molex.com/webdocs/datasheets/pdf/en-us/0473460001_IO_CONNECTORS.pdf; Lead Free: Yes; Manufacturer Part Number: 473460001; Contact Material: Gold,Nickel; Temperature Range High: +85°C; Device Class L3: unset
J202 = FTSH-107-01-F-DV-K-P-TR: Connector; Manufacturer_Name: SAMTEC; Datasheet Link: http://suddendocs.samtec.com/prints/ftsh-1xx-xx-xxx-dv-xxx-xxx-mkt.pdf; Manufacturer_Part_Number: FTSH-107-01-F-DV-K-P-TR; Mouser Part Number: 200-FTSH10701FDVKPTR; Mouser Price/Stock: https://www.mouser.co.uk/ProductDetail/Samtec/FTSH-107-01-F-DV-K-P-TR?qs=%252BZP6%2F%252BtExtAI0atx6lcXTg%3D%3D; Arrow Part Number: FTSH-107-01-F-DV-K-P-TR; Arrow Price/Stock: https://www.arrow.com/en/products/ftsh-107-01-f-dv-k-p-tr/samtec?region=nac
L200 L201 = CMP-06042-000097-1: Multilayer type RF Inductor 39nH ±5% 1.06Ω 250mA 0402; Core Material: Air; DC Resistance (DCR): 1.06R; Self Resonant Frequency: 1.2GHz; Max DC Current: 200mA; Q Factor: 8; Test Frequency: 100MHz; Shielding: Unshielded; Packaging: Tape and Reel; Tolerance: 5%; Lead Free: Lead Free; Height: 0.5mm; Height - Seated (Max): 0.022inch; Termination: SMD/SMT; Case Code (Metric): 1005; Depth: 0.55mm; Number of Pins: 2; Min Operating Temperature: -55°C; Case Code (Imperial): 0402; Military Standard: Not; Inductance Tolerance: 5%; Mount: Surface Mount; Max Operating Temperature: 125°C; REACH SVHC: No SVHC; Inductance: 39nH; Case/Package: 0402; Length: 1mm; Current Rating: 200mA; Width: 0.02inch; Package Quantity: 1; Radiation Hardening: No; DC Current: 200mA
LS200 = CMP-2000-05252-2: AUDIO PIEZO TRANSDUCER 12.5V SMD; Min Supply Voltage (DC): -12.5V; Self Resonant Frequency: 4kHz; Voltage Rating: 1.5V; Height: 1.9mm; Packaging: Tape and Reel; Min Operating Temperature: -40°C; Width: 9mm; Lead Free: Lead Free; Max Operating Temperature: 85°C; Max Supply Voltage (DC): 12.5V; Termination: Solder; Depth: 9mm; REACH SVHC: No SVHC; Frequency: 4kHz; Voltage Rating (DC): 12.5V; Radiation Hardening: No; Package Quantity: 2000; Length: 9mm; Mount: Surface Mount
Q200 = CMP-1048-00420-1: General Purpose Transistor, NPN Silicon, 3-Pin SC-75, Pb-Free, Tape and Reel; Manufacturer: On Semiconductor; IC Continuous (A): 0.2; fT Min (MHz): 300; ComponentLink3URL: http://www.onsemi.com/pub_link/Collateral/463-01.PDF; DatasheetVersion: Rev. 5; RoHS: TRUE; Mounting Technology: Surface Mount; ComponentLink1URL: http://www.onsemi.com/; ComponentLink3Description: Package Specification; PackageReference: SC-75-3-463-01; Polarity: NPN; ComponentLink2Description: Datasheet; PackageVersion: Rev. F, 07/2005; PartNumber: MMBT3904TT1G; ComponentLink2URL: http://www.onsemi.cn/pub_link/Collateral/MMBT3904TT1-D.PDF; ComponentLink1Description: Manufacturer URL; PackageDescription: 3-Pin Small Outline Transistor, Body 1.6 x 0.8 mm, Pitch 0.5 mm; Packing: Tape and Reel
R200 R201 R204-R209 = CMP-2002-07915-3: RES 10K OHM 5% 1/16W 0402; Max Power Dissipation: 63mW; Temperature Coefficient: 100ppm/°C; Power Rating: 62.5mW; Resistance: 10kR; Voltage Rating: 50V; Size Code: 0402; Resistance Tolerance: 5%; Packaging: Tape and Reel; Case Code (Metric): 1005; Lead Free: Lead Free; Resistor Type: Thick Film; Min Operating Temperature: -55°C; Military Standard: Not; Depth: 0.5mm; Series: RC; Case/Package: 0402; Construction: Rectangular; Number of Terminations: 2; Package Quantity: 1; Termination: SMD/SMT; Length: 0.039inch; Case Code (Imperial): 0402; Height: 0.016inch; Features: Moisture Resistant; RoHS Compliant: Yes; Max Operating Temperature: 155°C; Tolerance: 5%; Width: 0.02inch
R202 = CMP-1666-00003-5: RES Thick Film, 1kΩ, 1%, 0.1W, 100ppm/°C, 0603; Max Power Dissipation: 100mW; Voltage Rating: 75V; Resistance: 1kR; Max Operating Temperature: 155°C; Number of Pins: 2; Case Code (Imperial): 0603; Width: 0.033inch; Power Rating: 100mW; Number of Terminations: 2; Package Quantity: 10; Weight: 7.1E-05oz; Tolerance: 1%; Temperature Coefficient: 100ppm/°C; Military Standard: Not; Mount: Surface Mount; Voltage Rating (DC): 75V; Depth: 0.85mm; Composition: Thick Film; Radiation Hardening: No; Termination: SMD/SMT; Length: 1.55mm; Case Code (Metric): 1608; Contact Plating: Tin; Min Operating Temperature: -55°C; Packaging: Tape and Reel; Height: 0.45mm; Lead Free: Lead Free; Case/Package: 0603; Features: Automotive AEC-Q200
R210-R212 = CMP-08839-028975-1: 10kΩ ±5% 0.25W 0603 Anti-Surge Chip Resistor AEC-Q200; Resistance: 10kR; Power Rating: 250mW; Temperature Coefficient: 200ppm/°C; Tolerance: 5%; Series: ESR03; Package Quantity: 5000; Length: 0.063inch; Height: 0.022inch; Lead Free: Lead Free; Case/Package: 0603; Case Code (Metric): 1608; Width: 0.031inch; Resistor Type: Thick Film; Max Power Dissipation: 250mW; Packaging: Tape and Reel; Mount: Surface Mount; Number of Terminations: 2; Case Code (Imperial): 0603; Max Operating Temperature: 155°C; Min Operating Temperature: -55°C; RoHS Compliant: Yes
SW200 = CMP-10038-000023-1: SWITCH SLIDE SPDT 300MA 6V; Electrical Life: 5000Cycles; Actuator Type: Standard; Contact Resistance: 70mR; Actuator Material: Nylon; Max Voltage Rating (DC): 30V; Actuator Length: 2mm; Switch Function: On-On; Actuator Color: Black; Radiation Hardening: No; Throw Configuration: SPDT; Depth: 7.5mm; Case/Package: SMD/SMT; Package Quantity: 4000; Min Operating Temperature: -40°C; Length: 8.5mm; Current Rating: 300mA; Mount: Surface Mount; Voltage Rating (DC): 6V; RoHS Compliant: Yes; Orientation: Straight; Housing Material: Nylon; Contact Plating: Silver; Max Operating Temperature: 85°C; Packaging: Tape and Reel; Switch Travel: 2mm; Max Current Rating: 300mA; Contact Material: Copper Alloy; Series: JS; Termination: Gull Wing
SW201 = CMP-17879-000004-1: SWITCH TACTILE SPST-NO 0.05A 12V; Switch Travel: 0.25mm; Actuator Length: 1mm; Electrical Life: 30000Cycles; Throw Configuration: SPST; Illumination Type: Non-Illuminated; Contact Resistance: 100mR; Actuator Material: Nylon; Switch Function: Off-Mom; Operating Force: 260gf; Current Rating: 50mA; Contact Material: Silver; Max Operating Temperature: 70°C; Case/Package: SMD/SMT; Min Operating Temperature: -20°C; Voltage Rating (DC): 12V; Orientation: Right Angle; Lead Free: Lead Free; Packaging: Tape and Reel; Termination: Gull Wing; Max Voltage Rating (DC): 12V; Contact Plating: Silver; Mechanical Life: 30000Cycles; Mount: Surface Mount; Color: Black; Package Quantity: 1
U200 = CMP-12105-000017-1: IC MCU 32BIT 128KB FLASH 100LQFP; Manufacturer: STMicroelectronics; Number Of Uart Channels: 9; Number Of I/Os: 82; Max Junction Temp: +125°C; Data Bus Width: 32bits; Ram Size: 1MBytes; Min Supply Voltage: 1.62V; Number Of Spi Channels: 6; Number Of Adc Channels: 36; Max Supply Voltage: 3.6V; Standoff Height: 0.05mm; Interface: I2C,SPI,UART,USART,CAN,USB,LIN,IrDA,Ethernet,I2S,Other; Number Of A/D Converters: 3; Number Of I2C Channels: 4; Memory Size: 128KBytes; Frequency: 480MHz; Number Of Timers/Counters: 20; Number Of Ethernet Channels: 1; Core Architecture: ARM Cortex-M7; Number Of Usb Channels: 2; Number Of Pwm Channels: 42; Ambient Temperature Range High: +85°C; Temperature: -40°C to +125°C; ComponentLink2URL: https://www.st.com/resource/en/datasheet/stm32h750vb.pdf; Device Class L2: Embedded Processors and Controllers; Temperature Range Low: -40°C; Octopart: https://octopart.com/stm32h750vbt6-stmicroelectronics-94048547; Category: IC; Manufacturer Part Number: STM32H750VBT6; Height: 1.6mm; Lead Free: Yes; Device Class L1: Integrated Circuits (ICs); Digikey Description: IC MCU 32BIT 128KB FLASH 100LQFP; RoHS: TRUE; Ambient Temperature Range Low: -40°C; Device Class L3: Microcontrollers; ComponentLink2Description: Datasheet; Mouser Description: MCU 32-Bit STM32H750VB ARM Cortex M7 RISC 128KB Flash 1.8V/2.5V/3.3V 100-Pin LQFP Tray; Number Of Cores: 1; Automotive: No; Memory Type: FLASH; Package: LQFP100-1L; Temperature Range High: +125°C
U202 = CMP-2000-05154-1: 3-Axis Gyroscope and 3-Axis Accelerometer Motion Processing Unit with I2C and SPI, 1.71 to 3.45 V, -40 to 85 degC, 24-Pin QFN, RoHS, Tape and Reel; Manufacturer: InvenSense; Online Catalog: MPU-6500Series; Output Type: Digital; Sensor Type: GyroscopeandAccelerometer; Featured Product: InvenSense-MPU-6500Six-Axis(Gyro+Acceleromete)MEMSMotionTrackingDevices; Other Names: 1428-1011-6; Article Library: MCUsasSensorHubs; Series: -; Category: Sensors,Transducers; Dynamic Catalog: MPU-6500Series; Standard Package: 1; Manufacturer URL: http://www.invensense.com/; Family: Multifunction; Datasheet Version: Rev. 1.0, 09/2013; Datasheet URL: https://datasheet.ciiva.com/29175/mpu-6500-spec-29175093.pdf
U203 = CMP-12182-000004-1: MEMS NANO PRESSURE SENSOR: 260-1; Manufacturer: STMicroelectronics; Sensor Output: I2C,SPI; Port Style: No Port; Max Supply Voltage: 3.6V; Operating Supply Current: 3-12uA; Min Supply Voltage: 1.7V; Device Class L3: unset; Device Class L1: Sensors; Manufacturer Part Number: LPS22HBTR; Temperature Range High: +85°C; Digikey Description: MEMS NANO PRESSURE SENSOR: 260-1; Device Class L2: Pressure Sensors; RoHS: TRUE; Lead Free: Yes; Height: 0.8mm; Automotive: No; Octopart: https://octopart.com/lps22hbtr-stmicroelectronics-51851131; Package: HLGA-10L-8479831; Temperature Range Low: -40°C; Category: IC; Temperature: -40°C to +85°C; ComponentLink2Description: Datasheet; ComponentLink2URL: https://www.st.com/resource/en/datasheet/lps22hb.pdf; Footprint Url: https://www.st.com/content/ccc/resource/technical/document/technical_note/73/17/9c/16/dd/96/4a/01/CD00134799.pdf/files/CD00134799.pdf/jcr:content/translations/en.CD00134799.pdf
U204 U205 = CMP-32876-000004-1: SENSOR HALL EFFECT I2C
Y200 = ASE-48.000MHZ-LC-T: Crystal or Oscillator; Manufacturer_Name: ABRACON; Datasheet Link: https://abracon.com/Oscillators/ASEseries.pdf; Height: 1.2mm; Manufacturer_Part_Number: ASE-48.000MHZ-LC-T; Mouser Part Number: 815-ASE48.000MHZLCT; Mouser Price/Stock: https://www.mouser.co.uk/ProductDetail/ABRACON/ASE-48.000MHZ-LC-T?qs=ShQ8XZQtgRv3W0R1SSyS%252BQ%3D%3D; Arrow Part Number: ASE-48.000MHZ-LC-T; Arrow Price/Stock: https://www.arrow.com/en/products/ase-48.000mhz-lc-t/abracon

## Sheet Power.SchDoc
size A4; SheetNumber: 2; SheetTotal: 4
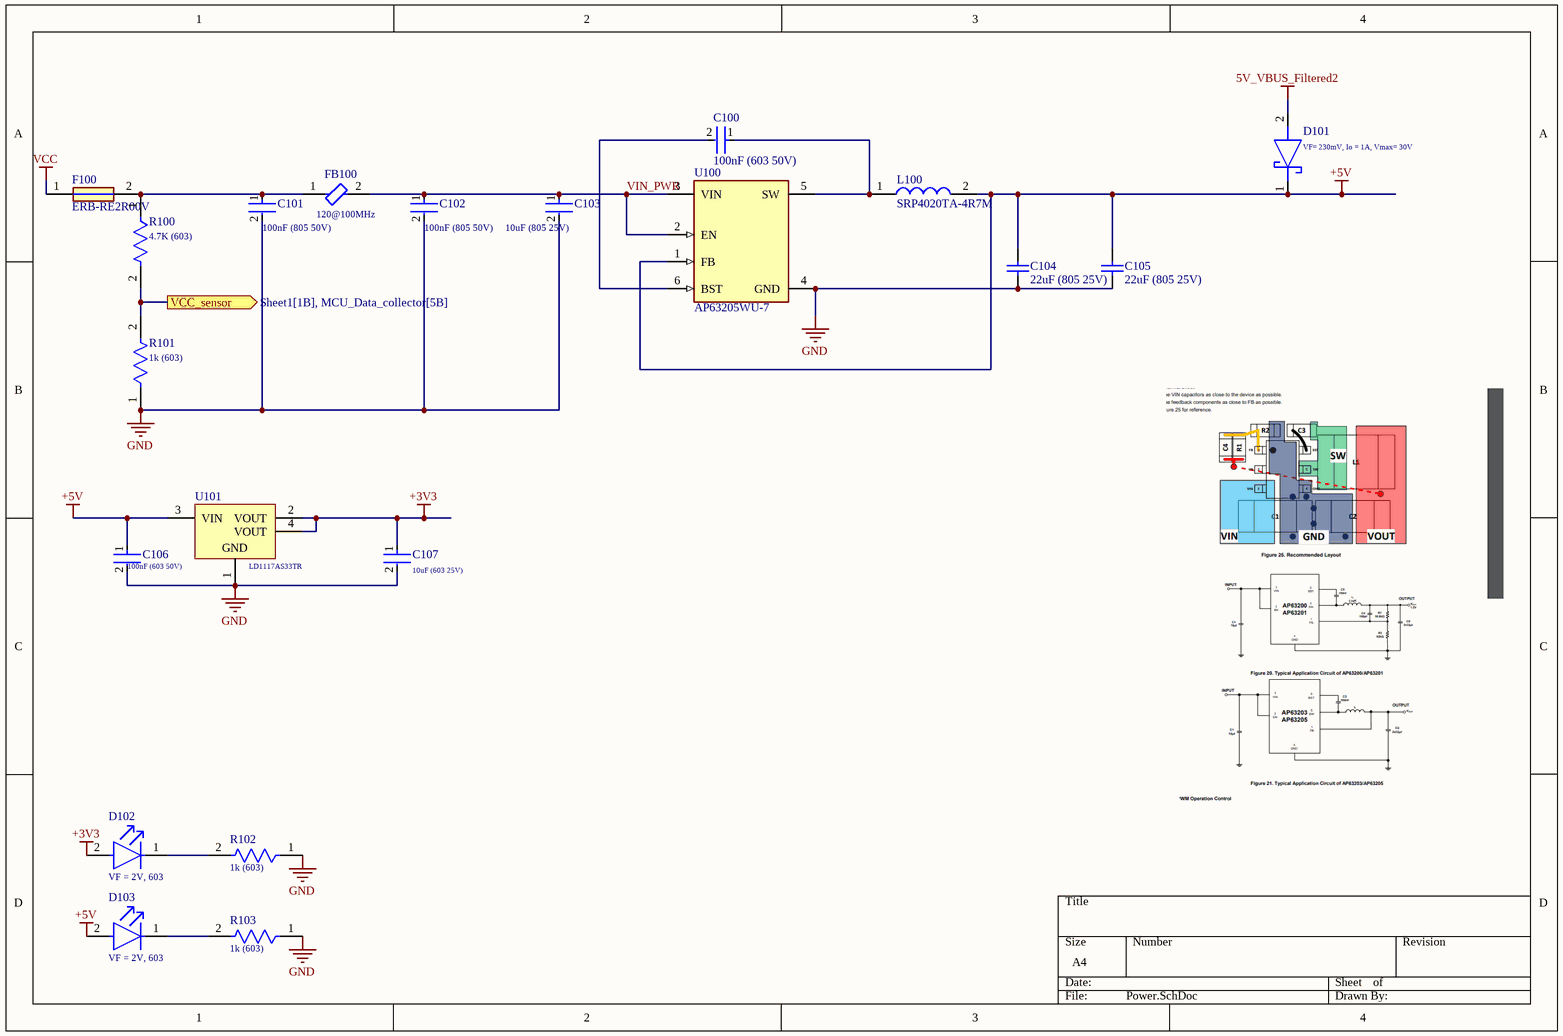
[diagram p4: Power.SchDoc]

### Parts
C100  100nF (603 50V)  [FP-CC0603-DA-MFG]
C101  100nF (805 50V)  [FP-CL779-IPC_C]
C102  100nF (805 50V)  [FP-CL779-IPC_C]
C103  10uF (805 25V)  [FP-CL21-IPC_A]
C104  22uF (805 25V)  [CAPC2013X140X45LL15T25]
C105  22uF (805 25V)  [CAPC2013X140X45LL15T25]
C106  100nF (603 50V)  [FP-CC0603-DA-MFG]
C107  10uF (603 25V)  [FP-CL10-IPC_C]
D101  VF= 230mV, Io = 1A, Vmax= 30V  [1SS357TPH3F]
D102  VF = 2V, 603  [FP-LTST-C191KGKT-MFG]
D103  VF = 2V, 603  [FP-LTST-C191KGKT-MFG]
F100  ERB-RE2R00V  [ERBRE0R50V]
FB100  120@100MHz  [FP-BLM18-0_15-t0_8-MFG]
L100  SRP4020TA-4R7M  [INDPM4441X200N]
R100  4.7K (603)  [FP-CRCW0603-e3-IPC_A]
R101  1k (603)  [FP-CRCW0603-e3-MFG]
R102  1k (603)  [FP-CRCW0603-e3-MFG]
R103  1k (603)  [FP-CRCW0603-e3-MFG]
U100  AP63205WU-7  [FP-TSOT26-MFG]
U101  LD1117AS33TR  [SOT-223_M]

### Ports
VCC_sensor (out, see Sheet1[1B], MCU_Data_collector[5B])

### Nets
5V_VBUS_Filtered2: D101.2(A)
+3V3: C107.1 D102.2(A) U101.2(VOUT) U101.4(VOUT)
+5V: C104.2 C105.2 C106.1 D101.1(K) D103.2(A) L100.2 U100.1(FB) U101.3(VIN)
GND: C101.2 C102.2 C103.2 C104.1 C105.1 C106.2 C107.2 R101.1 R102.1 R103.1 U100.4(GND) U101.1(GND)
VCC: F100.1
VCC_sensor: R100.2 R101.2 ; port VCC_sensor
VIN_PWR: C102.1 C103.1 FB100.2 U100.2(EN) U100.3(VIN)
NetC100_1: C100.1 L100.1 U100.5(SW)
NetC100_2: C100.2 U100.6(BST)
NetC101_1: C101.1 F100.2 FB100.1 R100.1
NetD102_1: D102.1(C) R102.2
NetD103_1: D103.1(C) R103.2

### Library data of the parts
C100 C106 = CMP-2100-03601-2: CAP CER 0.1UF 50V X7R 0603; Manufacturer: YAGEO; Manufacturer Part Number: CC0603KRX7R9BB104; Material: Ceramic; Temperature Coefficient: 15%; Tolerance: 0.1; Height: 0.9mm; Voltage: 50 V; ComponentLink2Description: Datasheet; Device Class L2: Capacitors; Temperature Range High: +125°C; Category: Cap; Capacitance: 100 nF; Footprint Url: http://www.yageo.com/exep/pages/download/literatures/UPY-C_GEN_24.pdf; ComponentLink2URL: http://www.yageo.com/documents/recent/UPY-GPHC_X7R_6.3V-to-50V_18.pdf; Package: CC0603-DA; Temperature: -55°C to +125°C; Voltage Rating: 50 V; Temperature Characteristic: X7R; Device Class L1: Passive Components; Temperature Range Low: -55°C; RoHS: TRUE; Automotive: No; Value: 100 nF; Device Class L3: Ceramic Capacitors; Octopart: https://octopart.com/cc0603krx7r9bb104-yageo-42244635; Mouser Description: Multilayer Ceramic Capacitor, CC Series, 0.1 - F, - 10%, X7R, 50 V, 0603 [1608 Metric]; Lead Free: Yes; Digikey Description: CAP CER 0.1UF 50V X7R 0603
C101 C102 = CMP-13271-002336-1: as C301 on sheet RF_Data
C103 = CMP-13271-002975-1: CL21 Series 0805 10uF 25V ±10% Tolerance X5R Multilayer Ceramic Chip Capacitor; Case Code (Imperial): 0805; Length: 2mm; Case/Package: 0805; Packaging: Tape and Reel; Width: 0.049inch; Tolerance: 10%; Mount: Surface Mount; Min Operating Temperature: -55°C; Thickness: 0.057inch; Height: 1.25mm; Dielectric: X5R; Package Quantity: 1; Depth: 1.25mm; Capacitance: 10uF; Voltage Rating: 25V; Case Code (Metric): 2012; Max Operating Temperature: 85°C; Radiation Hardening: No
C104 C105 = CMP-2000-06104-1: Multi-layer Ceramic Capacitor, 22 uF, -55 to 85 degC, 2-Pin SMD (0805), RoHS, Tape and Reel; Manufacturer: Samsung Electro-Mechanics; Other Names: 1276-2908-2; Capacitance: 22µF; Featured Product: Multi-LayerCeramicCapacitors; Product Training Modules: HighCapMLCCFamily; Temperature Coefficient: X5R; Tolerance: ±20%; Online Catalog: CLSeries,HighCapacitance; Applications: GeneralPurpose; RoHS Information: MLCCRoHS2Compliance; Height - Seated (Max): -; Voltage - Rated: 25V; Lead Style: -; Lead Spacing: -; Datasheet URL: http://datasheet.octopart.com/CL21A226MAQNNNE-Samsung-datasheet-48647558.pdf; Size / Dimension: 0.079"Lx0.049"W(2.00mmx1.25mm); Thickness (Max): 0.055"(1.40mm); Family: CeramicCapacitors; Package Description: 2-Pin Surface Mount Device, Body 2.0 x 1.25 mm; Datasheet Version: 07/2015; Packaging: Tape&Reel(TR); Manufacturer URL: http://www.samsungsem.com/global/index.jsp; Ratings: -; Package / Case: 0805(2012Metric); Standard Package: 2,000; Mounting Type: SurfaceMount,MLCC; Mounting Technology: SurfaceMount; Category: Capacitors; Package Reference: 0805; Series: CL; Features: -; Operating Temperature: -55°C~85°C
C107 = CMP-13271-004224-1: Cap Ceramic 10uF 25V X5R ±20% Pad SMD 0603 +85°C T/R; Width: 0.031inch; Voltage Rating: 25V; Length: 0.063inch; Case Code (Metric): 1608; Dielectric: X5R; Termination: Wraparound; Capacitance: 10uF; Lead Free: Lead Free; Mount: Surface Mount; Package Quantity: 1; Case Code (Imperial): 0603; Thickness: 0.035inch; Packaging: Tape and Reel; Contact Plating: Tin; Min Operating Temperature: -55°C; Tolerance: 20%; Max Operating Temperature: 85°C; Case/Package: 0603
D101 = CUS10S30,H3F: Schottky Diode; Manufacturer_Name: Toshiba; Datasheet Link: http://toshiba.semicon-storage.com/info/docget.jsp?did=14077&prodName=CUS10S30; Height: 1mm; Manufacturer_Part_Number: CUS10S30,H3F; Mouser Part Number: 757-CUS10S30H3F; Mouser Price/Stock: https://www.mouser.co.uk/ProductDetail/Toshiba/CUS10S30H3F?qs=cW4DzVrAanO4Xm6ySrHr7g%3D%3D; Arrow Part Number: CUS10S30,H3F; Arrow Price/Stock: https://www.arrow.com/en/products/cus10s30h3f/toshiba?region=nac
D102 D103 = CMP-2000-05198-2: as D200 on sheet MCU_Data_collector; Width: 0.8mm; Case Code (Imperial): 0603; Number of Pins: 2; Lead Free: Lead Free; Forward Voltage: 2V; Packaging: Tape and Reel; Package Quantity: 1; Min Operating Temperature: -55°C; Case/Package: 0603; Length: 1.6mm; Power Dissipation: 75mW; Depth: 0.8mm; Radiation Hardening: No; Mount: Surface Mount; Max Operating Temperature: 85°C; Color: Green; Power Rating: 75mW; Height: 0.55mm; Illumination Color: Green; Case Code (Metric): 1608; Lens Transparency: Clear; Number of Elements: 1
F100 = ERB-RE2R00V: Fuse; Manufacturer_Name: Panasonic; Datasheet Link: https://industrial.panasonic.com/cdbs/www-data/pdf/AFA0000/AFA0000C7.pdf; Height: 0.64mm; Manufacturer_Part_Number: ERB-RE2R00V; Mouser Part Number: 667-ERB-RE2R00V; Mouser Price/Stock: https://www.mouser.co.uk/ProductDetail/Panasonic/ERB-RE2R00V?qs=YIEcsSB2Lz7FNCZyYhOhwA%3D%3D; Arrow Part Number: ERB-RE2R00V; Arrow Price/Stock: https://www.arrow.com/en/products/erb-re2r00v/panasonic?region=nac
FB100 = CMP-0686-00493-3: as FB201 on sheet MCU_Data_collector; Core Material: Ferrite; Max DC Current: 200mA; Radiation Hardening: No; Max Current Rating: 200mA; Min Operating Temperature: -55°C; REACH SVHC: No SVHC; Packaging: Tape and Reel; Depth: 0.8mm; Tolerance: 25%; Weight: 7.1E-05oz; RoHS Compliant: Yes; Case/Package: 0603; Series: BLM18R; Number of Pins: 2; Length: 1.6mm; Case Code (Imperial): 0603; Package Quantity: 1; Contact Plating: Tin; Terminal Finish: Tin; Height: 0.8mm; DC Resistance (DCR): 250mR; Lead Free: Lead Free; Number of Functions: 1; Termination: Flat; Width: 0.8mm; Case Code (Metric): 1608; Max Operating Temperature: 125°C; Number of Circuits: 1; Test Frequency: 100MHz; Current Rating: 200mA
L100 = SRP4020TA-4R7M: Inductor; Manufacturer_Name: Bourns; Datasheet Link: https://www.bourns.com/docs/Product-Datasheets/SRP4020TA.pdf; Height: 2mm; Manufacturer_Part_Number: SRP4020TA-4R7M; Mouser Part Number: 652-SRP4020TA-4R7M; Mouser Price/Stock: https://www.mouser.co.uk/ProductDetail/Bourns/SRP4020TA-4R7M?qs=Ph8%2FHnX6CQw5tQY81n%2FCeg%3D%3D; Arrow Part Number: SRP4020TA-4R7M; Arrow Price/Stock: https://www.arrow.com/en/products/srp4020ta-4r7m/bourns?region=nac
R100 = CMP-1666-00019-3: RES Thick Film, 4.7kΩ, 1%, 0.1W, 100ppm/°C, 0603; Resistance: 4.7kR; Voltage Rating: 75V; Power Rating: 100mW; Case Code (Metric): 1608; Military Standard: Not; Packaging: Tape and Reel; Termination: SMD/SMT; Temperature Coefficient: 100ppm/°C; Lead Free: Lead Free; Length: 1.55mm; Width: 0.85mm; Height: 0.45mm; Depth: 0.85mm; Weight: 7.1E-05oz; Case Code (Imperial): 0603; Contact Plating: Tin; Case/Package: 0603; Max Operating Temperature: 155°C; Mount: Surface Mount; Tolerance: 1%; Min Operating Temperature: -55°C; Package Quantity: 5000; Voltage Rating (DC): 75V; Composition: Thick Film
R101-R103 = CMP-1666-00003-5: as R202 on sheet MCU_Data_collector; Max Operating Temperature: 155°C; Number of Pins: 2; Case Code (Imperial): 0603; Width: 0.033inch; Power Rating: 100mW; Number of Terminations: 2; Package Quantity: 10; Weight: 7.1E-05oz; Tolerance: 1%; Temperature Coefficient: 100ppm/°C; Military Standard: Not; Mount: Surface Mount; Voltage Rating (DC): 75V; Depth: 0.85mm; Composition: Thick Film; Radiation Hardening: No; Termination: SMD/SMT; Length: 1.55mm; Case Code (Metric): 1608; Contact Plating: Tin; Min Operating Temperature: -55°C; Packaging: Tape and Reel; Height: 0.45mm; Lead Free: Lead Free; Case/Package: 0603; Features: Automotive AEC-Q200
U100 = CMP-12757-000001-1: IC REG BUCK 5V 2A TSOT26; Manufacturer: Diodes Inc.; Max Junction Temp: +160°C; Max Duty Cycle: 100%; Standoff Height: 0.01mm; Max Supply Voltage: 32V; Number Of Outputs: 1; Min Supply Voltage: 3.8V; Output Type: Fixed; Switching Frequency: 1100kHz; Nominal Supply Current: 22uA; Automotive: No; RoHS: TRUE; Switching Topology: Buck; Temperature: -40°C to +85°C; Footprint Url: https://www.diodes.com/assets/Package-Files/TSOT26.pdf; Lead Free: Yes; Digikey Description: IC REG BUCK 5V 2A TSOT26; Device Class L3: Voltage Regulators - Switching; Ambient Temperature Range High: +85°C; Category: IC; Package: TSOT26; Output Voltage: 5V; Output Current: 2A; ComponentLink2Description: Datasheet; Device Class L2: Power Management ICs; Ambient Temperature Range Low: -40°C; Temperature Range High: +85°C; Temperature Range Low: -40°C; Octopart: https://octopart.com/ap63205wu-7-diodes+inc.-98099551; Manufacturer Part Number: AP63205WU-7; Height: 1mm; Device Class L1: Integrated Circuits (ICs); ComponentLink2URL: https://www.diodes.com/assets/Datasheets/AP63200-AP63201-AP63203-AP63205.pdf
U101 = CMP-0244-00316-1: 1A, Low Drop Positive Voltage Regulator, 3.3V, 4-Pin SOT-223, Tape and Reel; ComponentLink1Description: Manufacturer URL; DatasheetVersion: 2/12/2011; PackageVersion: 2010; ComponentLink1URL: http://www.st.com; ComponentLink2Description: Datasheet; ComponentLink2URL: http://www.st.com/internet/com/TECHNICAL_RESOURCES/TECHNICAL_LITERATURE/DATASHEET/CD00002116.pdf; PackageDescription: 4-Pin SOT-223 Package, 6.5 x 3.5 mm Body, 2.3 mm Pitch, 7 mm Lead Span; PackageReference: SOT-223

## Nets that join several sheets
5V_VBUS_Filtered2: MCU_Data_collector (C222.1 FB201.2), Power (D101.2)
+3V3: RF_Data (9 pins), MCU_Data_collector (42 pins), Power (C107.1 D102.2 U101.2 U101.4)
+5V: MCU_Data_collector (C230.1 LS200.1), Power (8 pins)
GND: RF_Data (29 pins), MCU_Data_collector (61 pins), Power (12 pins)
Busy: RF_Data (IC301.7), MCU_Data_collector (U200.47)
CS_GPS: RF_Data (IC300.18), MCU_Data_collector (U200.62)
DIO1: RF_Data (IC301.8), MCU_Data_collector (U200.45)
DIO2: RF_Data (IC301.9), MCU_Data_collector (U200.44)
DIO3: RF_Data (IC301.10), MCU_Data_collector (U200.43)
GPS_NRST: RF_Data (IC300.8), MCU_Data_collector (U200.61)
LORA_CS: RF_Data (IC301.19), MCU_Data_collector (U200.51)
LORA_NRST: RF_Data (IC301.3), MCU_Data_collector (U200.46)
MISO_2: RF_Data (IC300.20 IC301.16), MCU_Data_collector (U200.53)
MOSI_2: RF_Data (IC300.21 IC301.17), MCU_Data_collector (U200.54)
SCLK_2: RF_Data (IC300.19 IC301.18), MCU_Data_collector (U200.52)
VCC_sensor: MCU_Data_collector (U200.17), Power (R100.2 R101.2)